# EAGLE schematic adc (EAGLE 7.5.0)
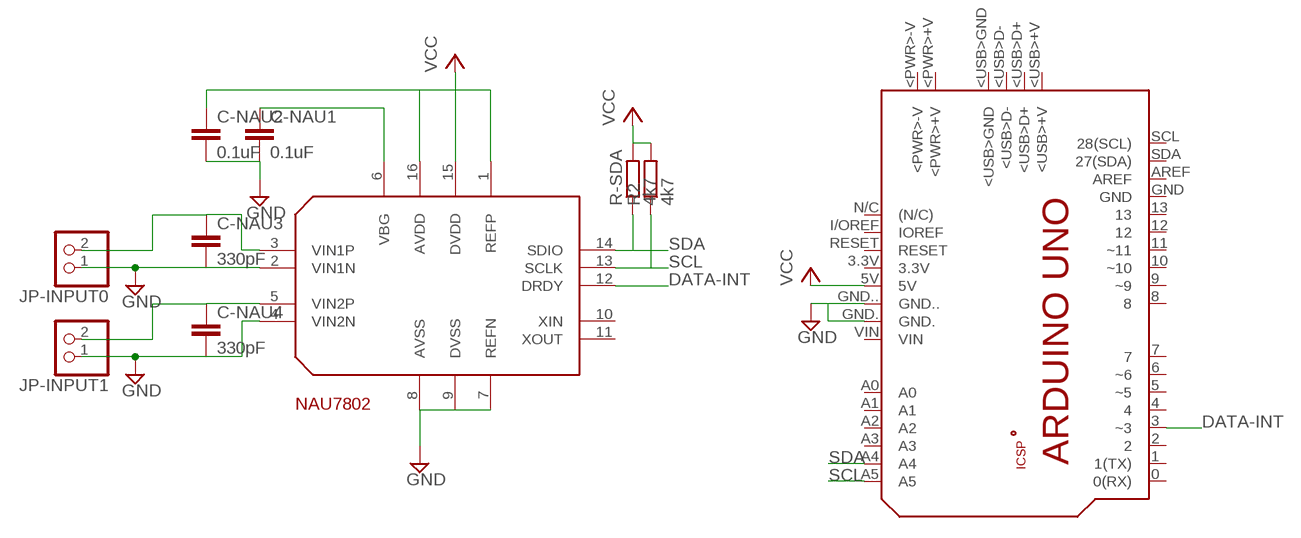
[diagram p0: schematic, sheet 1]

## Parts
C-NAU1  0.1uF  C-EU050-024X044  [C050-024X044]
C-NAU2  0.1uF  C-EU050-024X044  [C050-024X044]
C-NAU3  330pF  C-EU050-024X044  [C050-024X044]
C-NAU4  330pF  C-EU050-024X044  [C050-024X044]
JP-INPUT0  PINHD-1X2  [1X02]
JP-INPUT1  PINHD-1X2  [1X02]
PCB1  ARDUINO_UNO  [ARDUINO_UNO]
R2  4k7  R-EU_0204/7  [0204/7]
R-SDA  4k7  R-EU_0204/7  [0204/7]
U$1  NAU7802_DIP  [DIP16]

## Nets
DATA-INT: PCB1.3(~3) U$1.12(DRDY)
GND: C-NAU1.2 C-NAU2.2 C-NAU3.2 C-NAU4.2 JP-INPUT0.1 JP-INPUT1.1 PCB1.GND. PCB1.GND.. U$1.2(VIN1N) U$1.4(VIN2N) U$1.7(REFN) U$1.8(AVSS) U$1.9(DVSS)
N$1: C-NAU1.1 U$1.6(VBG)
N$5: C-NAU3.1 JP-INPUT0.2 U$1.3(VIN1P)
N$6: C-NAU4.1 JP-INPUT1.2 U$1.5(VIN2P)
SCL: PCB1.A5 R2.1 U$1.13(SCLK)
SDA: PCB1.A4 R-SDA.1 U$1.14(SDIO)
VCC: C-NAU2.1 PCB1.5V R2.2 R-SDA.2 U$1.1(REFP) U$1.15(DVDD) U$1.16(AVDD)
Unconnected: PCB1.0(0(RX)) PCB1.1(1(TX)) PCB1.2 PCB1.3.3V PCB1.4 PCB1.5(~5) PCB1.6(~6) PCB1.7 PCB1.8 PCB1.9(~9) PCB1.10(~10) PCB1.11(~11) PCB1.12 PCB1.13 PCB1.+5V PCB1.<PWR>+V PCB1.<PWR>-V PCB1.<USB>+V PCB1.<USB>D+ PCB1.<USB>D- PCB1.<USB>GND PCB1.A0 PCB1.A1 PCB1.A2 PCB1.A3 PCB1.AREF PCB1.GND PCB1.GND_ PCB1.I/OREF(IOREF) PCB1.MISO PCB1.MOSI PCB1.N/C((N/C)) PCB1.RESET PCB1.RESET. PCB1.SCK PCB1.SCL(28(SCL)) PCB1.SDA(27(SDA)) PCB1.VIN U$1.10(XIN) U$1.11(XOUT)

## Library data of the parts
C-NAU1-C-NAU4 = rcl:C-EU: CAPACITOR, European symbol
JP-INPUT0 JP-INPUT1 = pinhead:PINHD-1X2: PIN HEADER
PCB1 = E14_Arduino_revB:ARDUINO_UNO: Device for representing an Arduino Uno board with a footprint in an EAGLE design. Created by Dave Young for Element14. More EAGLE documentation at: http://www.element14.com/community/community/knode/cadsoft_eagle
R2 R-SDA = rcl:R-EU_: RESISTOR, European symbol
U$1 = nau7802:NAU7802_DIP